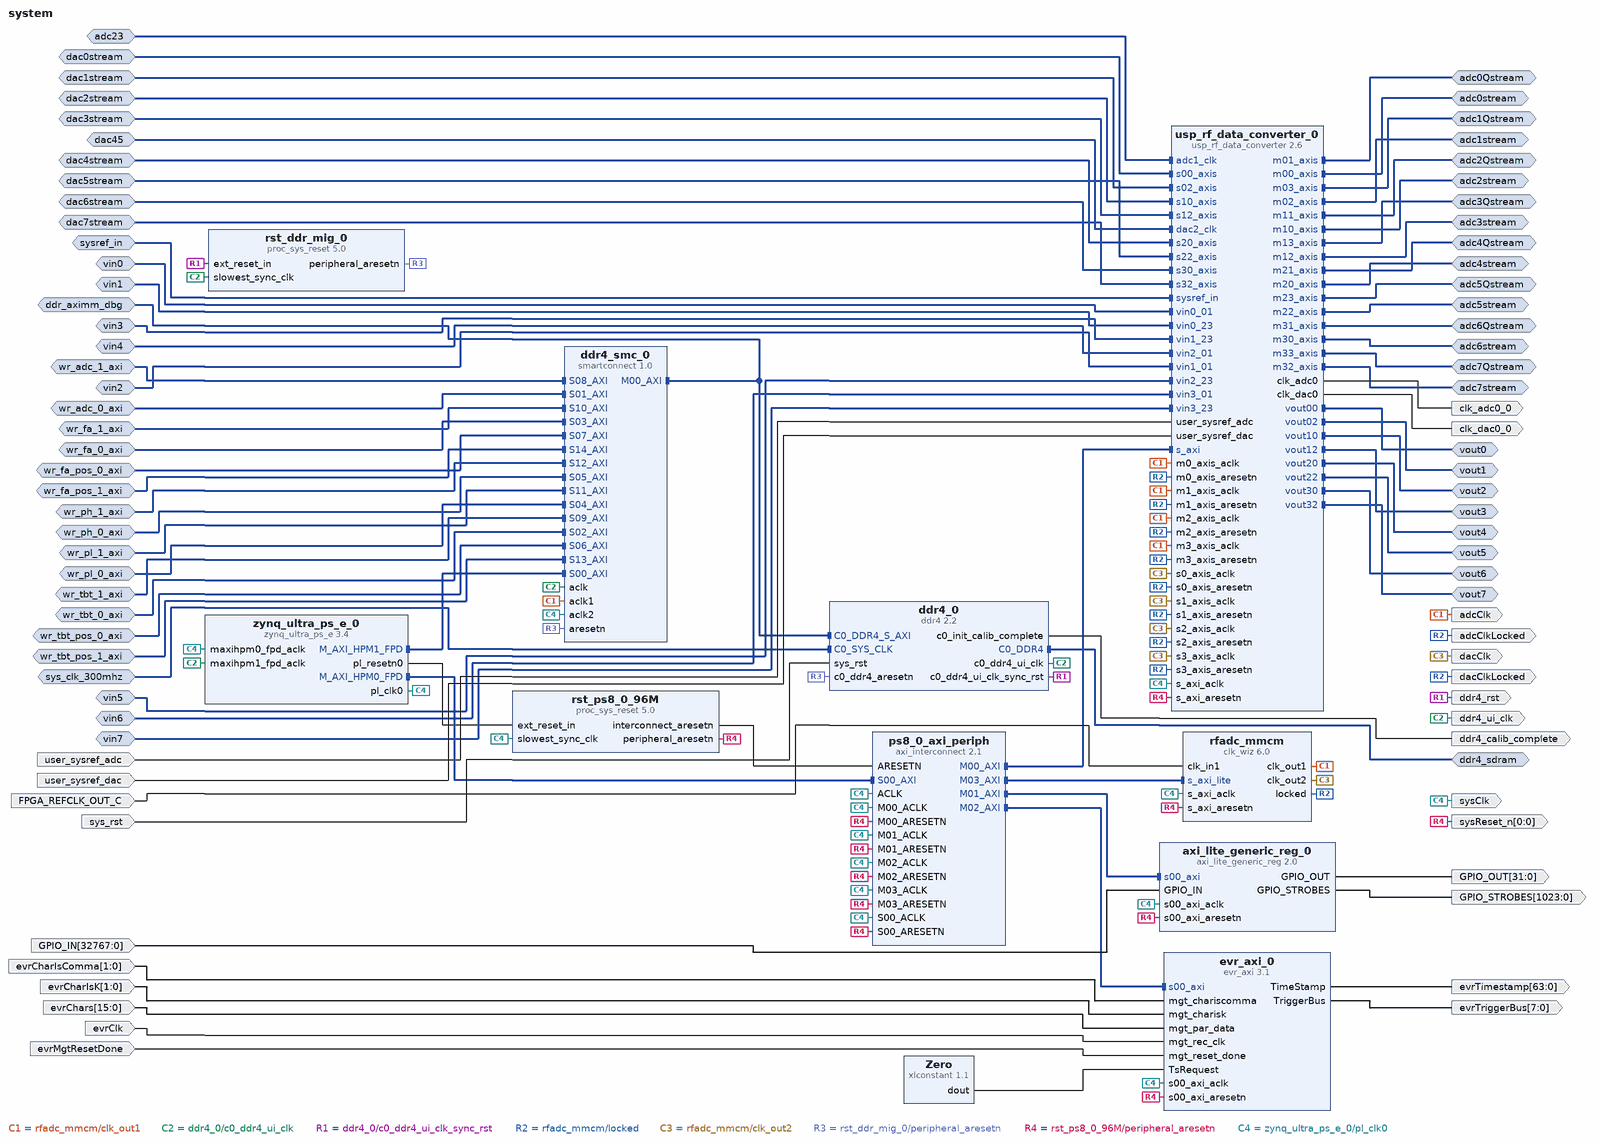
[diagram p0: block diagram of the top level]
# Vivado block design system, xczu48dr-fsvg1517-2-e, Vivado 2022.1
create_bd_design system

create_bd_intf_port -mode Slave -vlnv xilinx.com:display_usp_rf_data_converter:diff_pins_rtl:1.0 sysref_in
create_bd_intf_port -mode Master -vlnv xilinx.com:interface:axis_rtl:1.0 adc3stream
set_property -dict {CONFIG.FREQ_HZ 123386707} [get_bd_intf_ports adc3stream]
create_bd_intf_port -mode Master -vlnv xilinx.com:interface:axis_rtl:1.0 adc4stream
set_property -dict {CONFIG.FREQ_HZ 123386707} [get_bd_intf_ports adc4stream]
create_bd_intf_port -mode Master -vlnv xilinx.com:interface:axis_rtl:1.0 adc5stream
set_property -dict {CONFIG.FREQ_HZ 123386707} [get_bd_intf_ports adc5stream]
create_bd_intf_port -mode Master -vlnv xilinx.com:interface:axis_rtl:1.0 adc0stream
set_property -dict {CONFIG.FREQ_HZ 123386707} [get_bd_intf_ports adc0stream]
create_bd_intf_port -mode Master -vlnv xilinx.com:interface:axis_rtl:1.0 adc1stream
set_property -dict {CONFIG.FREQ_HZ 123386707} [get_bd_intf_ports adc1stream]
create_bd_intf_port -mode Master -vlnv xilinx.com:interface:axis_rtl:1.0 adc2stream
set_property -dict {CONFIG.FREQ_HZ 123386707} [get_bd_intf_ports adc2stream]
create_bd_intf_port -mode Slave -vlnv xilinx.com:interface:diff_analog_io_rtl:1.0 vin0
create_bd_intf_port -mode Slave -vlnv xilinx.com:interface:diff_analog_io_rtl:1.0 vin3
create_bd_intf_port -mode Slave -vlnv xilinx.com:interface:diff_analog_io_rtl:1.0 vin4
create_bd_intf_port -mode Slave -vlnv xilinx.com:interface:diff_analog_io_rtl:1.0 vin5
create_bd_intf_port -mode Slave -vlnv xilinx.com:interface:diff_analog_io_rtl:1.0 vin1
create_bd_intf_port -mode Slave -vlnv xilinx.com:interface:diff_analog_io_rtl:1.0 vin2
create_bd_intf_port -mode Slave -vlnv xilinx.com:interface:diff_clock_rtl:1.0 adc23
set_property -dict {CONFIG.FREQ_HZ 500000000} [get_bd_intf_ports adc23]
create_bd_intf_port -mode Master -vlnv xilinx.com:interface:axis_rtl:1.0 adc6stream
set_property -dict {CONFIG.FREQ_HZ 123386707} [get_bd_intf_ports adc6stream]
create_bd_intf_port -mode Master -vlnv xilinx.com:interface:axis_rtl:1.0 adc7stream
set_property -dict {CONFIG.FREQ_HZ 123386707} [get_bd_intf_ports adc7stream]
create_bd_intf_port -mode Slave -vlnv xilinx.com:interface:diff_analog_io_rtl:1.0 vin6
create_bd_intf_port -mode Slave -vlnv xilinx.com:interface:diff_analog_io_rtl:1.0 vin7
create_bd_intf_port -mode Slave -vlnv xilinx.com:interface:diff_clock_rtl:1.0 dac45
set_property -dict {CONFIG.FREQ_HZ 500000000} [get_bd_intf_ports dac45]
create_bd_intf_port -mode Master -vlnv xilinx.com:interface:axis_rtl:1.0 adc0Qstream
set_property -dict {CONFIG.FREQ_HZ 123386707} [get_bd_intf_ports adc0Qstream]
create_bd_intf_port -mode Master -vlnv xilinx.com:interface:axis_rtl:1.0 adc1Qstream
set_property -dict {CONFIG.FREQ_HZ 123386707} [get_bd_intf_ports adc1Qstream]
create_bd_intf_port -mode Master -vlnv xilinx.com:interface:axis_rtl:1.0 adc2Qstream
set_property -dict {CONFIG.FREQ_HZ 123386707} [get_bd_intf_ports adc2Qstream]
create_bd_intf_port -mode Master -vlnv xilinx.com:interface:axis_rtl:1.0 adc3Qstream
set_property -dict {CONFIG.FREQ_HZ 123386707} [get_bd_intf_ports adc3Qstream]
create_bd_intf_port -mode Master -vlnv xilinx.com:interface:axis_rtl:1.0 adc4Qstream
set_property -dict {CONFIG.FREQ_HZ 123386707} [get_bd_intf_ports adc4Qstream]
create_bd_intf_port -mode Master -vlnv xilinx.com:interface:axis_rtl:1.0 adc5Qstream
set_property -dict {CONFIG.FREQ_HZ 123386707} [get_bd_intf_ports adc5Qstream]
create_bd_intf_port -mode Master -vlnv xilinx.com:interface:axis_rtl:1.0 adc6Qstream
set_property -dict {CONFIG.FREQ_HZ 123386707} [get_bd_intf_ports adc6Qstream]
create_bd_intf_port -mode Master -vlnv xilinx.com:interface:axis_rtl:1.0 adc7Qstream
set_property -dict {CONFIG.FREQ_HZ 123386707} [get_bd_intf_ports adc7Qstream]
create_bd_intf_port -mode Master -vlnv xilinx.com:interface:diff_analog_io_rtl:1.0 vout0
create_bd_intf_port -mode Master -vlnv xilinx.com:interface:diff_analog_io_rtl:1.0 vout1
create_bd_intf_port -mode Master -vlnv xilinx.com:interface:diff_analog_io_rtl:1.0 vout2
create_bd_intf_port -mode Master -vlnv xilinx.com:interface:diff_analog_io_rtl:1.0 vout3
create_bd_intf_port -mode Master -vlnv xilinx.com:interface:diff_analog_io_rtl:1.0 vout4
create_bd_intf_port -mode Master -vlnv xilinx.com:interface:diff_analog_io_rtl:1.0 vout5
create_bd_intf_port -mode Master -vlnv xilinx.com:interface:diff_analog_io_rtl:1.0 vout6
create_bd_intf_port -mode Master -vlnv xilinx.com:interface:diff_analog_io_rtl:1.0 vout7
create_bd_intf_port -mode Master -vlnv xilinx.com:interface:ddr4_rtl:1.0 ddr4_sdram
create_bd_intf_port -mode Slave -vlnv xilinx.com:interface:diff_clock_rtl:1.0 sys_clk_300mhz
set_property -dict {CONFIG.FREQ_HZ 300000000} [get_bd_intf_ports sys_clk_300mhz]
create_bd_intf_port -mode Slave -vlnv xilinx.com:interface:aximm_rtl:1.0 wr_adc_0_axi
set_property -dict [list \
  CONFIG.ADDR_WIDTH 35 \
  CONFIG.ARUSER_WIDTH 0 \
  CONFIG.AWUSER_WIDTH 0 \
  CONFIG.BUSER_WIDTH 0 \
  CONFIG.DATA_WIDTH 256 \
  CONFIG.FREQ_HZ 123386707 \
  CONFIG.HAS_BRESP 1 \
  CONFIG.HAS_BURST 1 \
  CONFIG.HAS_CACHE 1 \
  CONFIG.HAS_LOCK 0 \
  CONFIG.HAS_PROT 0 \
  CONFIG.HAS_QOS 0 \
  CONFIG.HAS_REGION 0 \
  CONFIG.HAS_RRESP 1 \
  CONFIG.HAS_WSTRB 1 \
  CONFIG.ID_WIDTH 0 \
  CONFIG.MAX_BURST_LENGTH 256 \
  CONFIG.NUM_READ_OUTSTANDING 1 \
  CONFIG.NUM_READ_THREADS 1 \
  CONFIG.NUM_WRITE_OUTSTANDING 1 \
  CONFIG.NUM_WRITE_THREADS 1 \
  CONFIG.PROTOCOL AXI4 \
  CONFIG.READ_WRITE_MODE WRITE_ONLY \
  CONFIG.RUSER_BITS_PER_BYTE 0 \
  CONFIG.RUSER_WIDTH 0 \
  CONFIG.SUPPORTS_NARROW_BURST 0 \
  CONFIG.WUSER_BITS_PER_BYTE 0 \
  CONFIG.WUSER_WIDTH 0 \
  CONFIG.master_id 3 \
] [get_bd_intf_ports wr_adc_0_axi]
create_bd_intf_port -mode Slave -vlnv xilinx.com:interface:aximm_rtl:1.0 wr_tbt_0_axi
set_property -dict [list \
  CONFIG.ADDR_WIDTH 35 \
  CONFIG.ARUSER_WIDTH 0 \
  CONFIG.AWUSER_WIDTH 0 \
  CONFIG.BUSER_WIDTH 0 \
  CONFIG.DATA_WIDTH 128 \
  CONFIG.HAS_BRESP 1 \
  CONFIG.HAS_BURST 1 \
  CONFIG.HAS_CACHE 1 \
  CONFIG.HAS_LOCK 0 \
  CONFIG.HAS_PROT 0 \
  CONFIG.HAS_QOS 0 \
  CONFIG.HAS_REGION 0 \
  CONFIG.HAS_RRESP 1 \
  CONFIG.HAS_WSTRB 1 \
  CONFIG.ID_WIDTH 0 \
  CONFIG.MAX_BURST_LENGTH 256 \
  CONFIG.NUM_READ_OUTSTANDING 1 \
  CONFIG.NUM_READ_THREADS 1 \
  CONFIG.NUM_WRITE_OUTSTANDING 1 \
  CONFIG.NUM_WRITE_THREADS 1 \
  CONFIG.PROTOCOL AXI4 \
  CONFIG.READ_WRITE_MODE WRITE_ONLY \
  CONFIG.RUSER_BITS_PER_BYTE 0 \
  CONFIG.RUSER_WIDTH 0 \
  CONFIG.SUPPORTS_NARROW_BURST 0 \
  CONFIG.WUSER_BITS_PER_BYTE 0 \
  CONFIG.WUSER_WIDTH 0 \
  CONFIG.master_id 4 \
] [get_bd_intf_ports wr_tbt_0_axi]
create_bd_intf_port -mode Slave -vlnv xilinx.com:interface:aximm_rtl:1.0 wr_fa_0_axi
set_property -dict [list \
  CONFIG.ADDR_WIDTH 35 \
  CONFIG.ARUSER_WIDTH 0 \
  CONFIG.AWUSER_WIDTH 0 \
  CONFIG.BUSER_WIDTH 0 \
  CONFIG.DATA_WIDTH 128 \
  CONFIG.HAS_BRESP 1 \
  CONFIG.HAS_BURST 1 \
  CONFIG.HAS_CACHE 1 \
  CONFIG.HAS_LOCK 0 \
  CONFIG.HAS_PROT 0 \
  CONFIG.HAS_QOS 0 \
  CONFIG.HAS_REGION 0 \
  CONFIG.HAS_RRESP 1 \
  CONFIG.HAS_WSTRB 1 \
  CONFIG.ID_WIDTH 0 \
  CONFIG.MAX_BURST_LENGTH 256 \
  CONFIG.NUM_READ_OUTSTANDING 1 \
  CONFIG.NUM_READ_THREADS 1 \
  CONFIG.NUM_WRITE_OUTSTANDING 1 \
  CONFIG.NUM_WRITE_THREADS 1 \
  CONFIG.PROTOCOL AXI4 \
  CONFIG.READ_WRITE_MODE WRITE_ONLY \
  CONFIG.RUSER_BITS_PER_BYTE 0 \
  CONFIG.RUSER_WIDTH 0 \
  CONFIG.SUPPORTS_NARROW_BURST 0 \
  CONFIG.WUSER_BITS_PER_BYTE 0 \
  CONFIG.WUSER_WIDTH 0 \
  CONFIG.master_id 5 \
] [get_bd_intf_ports wr_fa_0_axi]
create_bd_intf_port -mode Slave -vlnv xilinx.com:interface:aximm_rtl:1.0 wr_pl_0_axi
set_property -dict [list \
  CONFIG.ADDR_WIDTH 35 \
  CONFIG.ARUSER_WIDTH 0 \
  CONFIG.AWUSER_WIDTH 0 \
  CONFIG.BUSER_WIDTH 0 \
  CONFIG.DATA_WIDTH 128 \
  CONFIG.HAS_BRESP 1 \
  CONFIG.HAS_BURST 1 \
  CONFIG.HAS_CACHE 1 \
  CONFIG.HAS_LOCK 0 \
  CONFIG.HAS_PROT 0 \
  CONFIG.HAS_QOS 0 \
  CONFIG.HAS_REGION 0 \
  CONFIG.HAS_RRESP 1 \
  CONFIG.HAS_WSTRB 1 \
  CONFIG.ID_WIDTH 0 \
  CONFIG.MAX_BURST_LENGTH 256 \
  CONFIG.NUM_READ_OUTSTANDING 1 \
  CONFIG.NUM_READ_THREADS 1 \
  CONFIG.NUM_WRITE_OUTSTANDING 1 \
  CONFIG.NUM_WRITE_THREADS 1 \
  CONFIG.PROTOCOL AXI4 \
  CONFIG.READ_WRITE_MODE WRITE_ONLY \
  CONFIG.RUSER_BITS_PER_BYTE 0 \
  CONFIG.RUSER_WIDTH 0 \
  CONFIG.SUPPORTS_NARROW_BURST 0 \
  CONFIG.WUSER_BITS_PER_BYTE 0 \
  CONFIG.WUSER_WIDTH 0 \
  CONFIG.master_id 6 \
] [get_bd_intf_ports wr_pl_0_axi]
create_bd_intf_port -mode Slave -vlnv xilinx.com:interface:aximm_rtl:1.0 wr_ph_0_axi
set_property -dict [list \
  CONFIG.ADDR_WIDTH 35 \
  CONFIG.ARUSER_WIDTH 0 \
  CONFIG.AWUSER_WIDTH 0 \
  CONFIG.BUSER_WIDTH 0 \
  CONFIG.DATA_WIDTH 128 \
  CONFIG.HAS_BRESP 1 \
  CONFIG.HAS_BURST 1 \
  CONFIG.HAS_CACHE 1 \
  CONFIG.HAS_LOCK 0 \
  CONFIG.HAS_PROT 0 \
  CONFIG.HAS_QOS 0 \
  CONFIG.HAS_REGION 0 \
  CONFIG.HAS_RRESP 1 \
  CONFIG.HAS_WSTRB 1 \
  CONFIG.ID_WIDTH 0 \
  CONFIG.MAX_BURST_LENGTH 256 \
  CONFIG.NUM_READ_OUTSTANDING 1 \
  CONFIG.NUM_READ_THREADS 1 \
  CONFIG.NUM_WRITE_OUTSTANDING 1 \
  CONFIG.NUM_WRITE_THREADS 1 \
  CONFIG.PROTOCOL AXI4 \
  CONFIG.READ_WRITE_MODE WRITE_ONLY \
  CONFIG.RUSER_BITS_PER_BYTE 0 \
  CONFIG.RUSER_WIDTH 0 \
  CONFIG.SUPPORTS_NARROW_BURST 0 \
  CONFIG.WUSER_BITS_PER_BYTE 0 \
  CONFIG.WUSER_WIDTH 0 \
  CONFIG.master_id 7 \
] [get_bd_intf_ports wr_ph_0_axi]
create_bd_intf_port -mode Slave -vlnv xilinx.com:interface:aximm_rtl:1.0 wr_adc_1_axi
set_property -dict [list \
  CONFIG.ADDR_WIDTH 35 \
  CONFIG.ARUSER_WIDTH 0 \
  CONFIG.AWUSER_WIDTH 0 \
  CONFIG.BUSER_WIDTH 0 \
  CONFIG.DATA_WIDTH 256 \
  CONFIG.FREQ_HZ 123386707 \
  CONFIG.HAS_BRESP 1 \
  CONFIG.HAS_BURST 1 \
  CONFIG.HAS_CACHE 1 \
  CONFIG.HAS_LOCK 0 \
  CONFIG.HAS_PROT 0 \
  CONFIG.HAS_QOS 0 \
  CONFIG.HAS_REGION 0 \
  CONFIG.HAS_RRESP 1 \
  CONFIG.HAS_WSTRB 1 \
  CONFIG.ID_WIDTH 0 \
  CONFIG.MAX_BURST_LENGTH 256 \
  CONFIG.NUM_READ_OUTSTANDING 1 \
  CONFIG.NUM_READ_THREADS 1 \
  CONFIG.NUM_WRITE_OUTSTANDING 1 \
  CONFIG.NUM_WRITE_THREADS 1 \
  CONFIG.PROTOCOL AXI4 \
  CONFIG.READ_WRITE_MODE WRITE_ONLY \
  CONFIG.RUSER_BITS_PER_BYTE 0 \
  CONFIG.RUSER_WIDTH 0 \
  CONFIG.SUPPORTS_NARROW_BURST 0 \
  CONFIG.WUSER_BITS_PER_BYTE 0 \
  CONFIG.WUSER_WIDTH 0 \
  CONFIG.master_id 10 \
] [get_bd_intf_ports wr_adc_1_axi]
create_bd_intf_port -mode Slave -vlnv xilinx.com:interface:aximm_rtl:1.0 wr_fa_1_axi
set_property -dict [list \
  CONFIG.ADDR_WIDTH 35 \
  CONFIG.ARUSER_WIDTH 0 \
  CONFIG.AWUSER_WIDTH 0 \
  CONFIG.BUSER_WIDTH 0 \
  CONFIG.DATA_WIDTH 128 \
  CONFIG.HAS_BRESP 1 \
  CONFIG.HAS_BURST 1 \
  CONFIG.HAS_CACHE 1 \
  CONFIG.HAS_LOCK 0 \
  CONFIG.HAS_PROT 0 \
  CONFIG.HAS_QOS 0 \
  CONFIG.HAS_REGION 0 \
  CONFIG.HAS_RRESP 1 \
  CONFIG.HAS_WSTRB 1 \
  CONFIG.ID_WIDTH 0 \
  CONFIG.MAX_BURST_LENGTH 256 \
  CONFIG.NUM_READ_OUTSTANDING 1 \
  CONFIG.NUM_READ_THREADS 1 \
  CONFIG.NUM_WRITE_OUTSTANDING 1 \
  CONFIG.NUM_WRITE_THREADS 1 \
  CONFIG.PROTOCOL AXI4 \
  CONFIG.READ_WRITE_MODE WRITE_ONLY \
  CONFIG.RUSER_BITS_PER_BYTE 0 \
  CONFIG.RUSER_WIDTH 0 \
  CONFIG.SUPPORTS_NARROW_BURST 0 \
  CONFIG.WUSER_BITS_PER_BYTE 0 \
  CONFIG.WUSER_WIDTH 0 \
  CONFIG.master_id 12 \
] [get_bd_intf_ports wr_fa_1_axi]
create_bd_intf_port -mode Slave -vlnv xilinx.com:interface:aximm_rtl:1.0 wr_ph_1_axi
set_property -dict [list \
  CONFIG.ADDR_WIDTH 35 \
  CONFIG.ARUSER_WIDTH 0 \
  CONFIG.AWUSER_WIDTH 0 \
  CONFIG.BUSER_WIDTH 0 \
  CONFIG.DATA_WIDTH 128 \
  CONFIG.HAS_BRESP 1 \
  CONFIG.HAS_BURST 1 \
  CONFIG.HAS_CACHE 1 \
  CONFIG.HAS_LOCK 0 \
  CONFIG.HAS_PROT 0 \
  CONFIG.HAS_QOS 0 \
  CONFIG.HAS_REGION 0 \
  CONFIG.HAS_RRESP 1 \
  CONFIG.HAS_WSTRB 1 \
  CONFIG.ID_WIDTH 0 \
  CONFIG.MAX_BURST_LENGTH 256 \
  CONFIG.NUM_READ_OUTSTANDING 1 \
  CONFIG.NUM_READ_THREADS 1 \
  CONFIG.NUM_WRITE_OUTSTANDING 1 \
  CONFIG.NUM_WRITE_THREADS 1 \
  CONFIG.PROTOCOL AXI4 \
  CONFIG.READ_WRITE_MODE WRITE_ONLY \
  CONFIG.RUSER_BITS_PER_BYTE 0 \
  CONFIG.RUSER_WIDTH 0 \
  CONFIG.SUPPORTS_NARROW_BURST 0 \
  CONFIG.WUSER_BITS_PER_BYTE 0 \
  CONFIG.WUSER_WIDTH 0 \
  CONFIG.master_id 14 \
] [get_bd_intf_ports wr_ph_1_axi]
create_bd_intf_port -mode Slave -vlnv xilinx.com:interface:aximm_rtl:1.0 wr_pl_1_axi
set_property -dict [list \
  CONFIG.ADDR_WIDTH 35 \
  CONFIG.ARUSER_WIDTH 0 \
  CONFIG.AWUSER_WIDTH 0 \
  CONFIG.BUSER_WIDTH 0 \
  CONFIG.DATA_WIDTH 128 \
  CONFIG.HAS_BRESP 1 \
  CONFIG.HAS_BURST 1 \
  CONFIG.HAS_CACHE 1 \
  CONFIG.HAS_LOCK 0 \
  CONFIG.HAS_PROT 0 \
  CONFIG.HAS_QOS 0 \
  CONFIG.HAS_REGION 0 \
  CONFIG.HAS_RRESP 1 \
  CONFIG.HAS_WSTRB 1 \
  CONFIG.ID_WIDTH 0 \
  CONFIG.MAX_BURST_LENGTH 256 \
  CONFIG.NUM_READ_OUTSTANDING 1 \
  CONFIG.NUM_READ_THREADS 1 \
  CONFIG.NUM_WRITE_OUTSTANDING 1 \
  CONFIG.NUM_WRITE_THREADS 1 \
  CONFIG.PROTOCOL AXI4 \
  CONFIG.READ_WRITE_MODE WRITE_ONLY \
  CONFIG.RUSER_BITS_PER_BYTE 0 \
  CONFIG.RUSER_WIDTH 0 \
  CONFIG.SUPPORTS_NARROW_BURST 0 \
  CONFIG.WUSER_BITS_PER_BYTE 0 \
  CONFIG.WUSER_WIDTH 0 \
  CONFIG.master_id 13 \
] [get_bd_intf_ports wr_pl_1_axi]
create_bd_intf_port -mode Slave -vlnv xilinx.com:interface:aximm_rtl:1.0 wr_tbt_1_axi
set_property -dict [list \
  CONFIG.ADDR_WIDTH 35 \
  CONFIG.ARUSER_WIDTH 0 \
  CONFIG.AWUSER_WIDTH 0 \
  CONFIG.BUSER_WIDTH 0 \
  CONFIG.DATA_WIDTH 128 \
  CONFIG.HAS_BRESP 1 \
  CONFIG.HAS_BURST 1 \
  CONFIG.HAS_CACHE 1 \
  CONFIG.HAS_LOCK 0 \
  CONFIG.HAS_PROT 0 \
  CONFIG.HAS_QOS 0 \
  CONFIG.HAS_REGION 0 \
  CONFIG.HAS_RRESP 1 \
  CONFIG.HAS_WSTRB 1 \
  CONFIG.ID_WIDTH 0 \
  CONFIG.MAX_BURST_LENGTH 256 \
  CONFIG.NUM_READ_OUTSTANDING 1 \
  CONFIG.NUM_READ_THREADS 1 \
  CONFIG.NUM_WRITE_OUTSTANDING 1 \
  CONFIG.NUM_WRITE_THREADS 1 \
  CONFIG.PROTOCOL AXI4 \
  CONFIG.READ_WRITE_MODE WRITE_ONLY \
  CONFIG.RUSER_BITS_PER_BYTE 0 \
  CONFIG.RUSER_WIDTH 0 \
  CONFIG.SUPPORTS_NARROW_BURST 0 \
  CONFIG.WUSER_BITS_PER_BYTE 0 \
  CONFIG.WUSER_WIDTH 0 \
  CONFIG.master_id 11 \
] [get_bd_intf_ports wr_tbt_1_axi]
create_bd_intf_port -mode Monitor -vlnv xilinx.com:interface:aximm_rtl:1.0 ddr_aximm_dbg
set_property -dict [list \
  CONFIG.ADDR_WIDTH 32 \
  CONFIG.ARUSER_WIDTH 0 \
  CONFIG.AWUSER_WIDTH 0 \
  CONFIG.DATA_WIDTH 256 \
  CONFIG.PROTOCOL AXI4 \
] [get_bd_intf_ports ddr_aximm_dbg]
create_bd_intf_port -mode Slave -vlnv xilinx.com:interface:axis_rtl:1.0 dac0stream
set_property -dict [list \
  CONFIG.FREQ_HZ 123386707 \
  CONFIG.HAS_TKEEP 0 \
  CONFIG.HAS_TLAST 0 \
  CONFIG.HAS_TREADY 1 \
  CONFIG.HAS_TSTRB 0 \
  CONFIG.LAYERED_METADATA undef \
  CONFIG.TDATA_NUM_BYTES 4 \
  CONFIG.TDEST_WIDTH 0 \
  CONFIG.TID_WIDTH 0 \
  CONFIG.TUSER_WIDTH 0 \
] [get_bd_intf_ports dac0stream]
create_bd_intf_port -mode Slave -vlnv xilinx.com:interface:axis_rtl:1.0 dac1stream
set_property -dict [list \
  CONFIG.FREQ_HZ 123386707 \
  CONFIG.HAS_TKEEP 0 \
  CONFIG.HAS_TLAST 0 \
  CONFIG.HAS_TREADY 1 \
  CONFIG.HAS_TSTRB 0 \
  CONFIG.LAYERED_METADATA undef \
  CONFIG.TDATA_NUM_BYTES 4 \
  CONFIG.TDEST_WIDTH 0 \
  CONFIG.TID_WIDTH 0 \
  CONFIG.TUSER_WIDTH 0 \
] [get_bd_intf_ports dac1stream]
create_bd_intf_port -mode Slave -vlnv xilinx.com:interface:axis_rtl:1.0 dac2stream
set_property -dict [list \
  CONFIG.FREQ_HZ 123386707 \
  CONFIG.HAS_TKEEP 0 \
  CONFIG.HAS_TLAST 0 \
  CONFIG.HAS_TREADY 1 \
  CONFIG.HAS_TSTRB 0 \
  CONFIG.LAYERED_METADATA undef \
  CONFIG.TDATA_NUM_BYTES 4 \
  CONFIG.TDEST_WIDTH 0 \
  CONFIG.TID_WIDTH 0 \
  CONFIG.TUSER_WIDTH 0 \
] [get_bd_intf_ports dac2stream]
create_bd_intf_port -mode Slave -vlnv xilinx.com:interface:axis_rtl:1.0 dac3stream
set_property -dict [list \
  CONFIG.FREQ_HZ 123386707 \
  CONFIG.HAS_TKEEP 0 \
  CONFIG.HAS_TLAST 0 \
  CONFIG.HAS_TREADY 1 \
  CONFIG.HAS_TSTRB 0 \
  CONFIG.LAYERED_METADATA undef \
  CONFIG.TDATA_NUM_BYTES 4 \
  CONFIG.TDEST_WIDTH 0 \
  CONFIG.TID_WIDTH 0 \
  CONFIG.TUSER_WIDTH 0 \
] [get_bd_intf_ports dac3stream]
create_bd_intf_port -mode Slave -vlnv xilinx.com:interface:axis_rtl:1.0 dac4stream
set_property -dict [list \
  CONFIG.FREQ_HZ 123386707 \
  CONFIG.HAS_TKEEP 0 \
  CONFIG.HAS_TLAST 0 \
  CONFIG.HAS_TREADY 1 \
  CONFIG.HAS_TSTRB 0 \
  CONFIG.LAYERED_METADATA undef \
  CONFIG.TDATA_NUM_BYTES 4 \
  CONFIG.TDEST_WIDTH 0 \
  CONFIG.TID_WIDTH 0 \
  CONFIG.TUSER_WIDTH 0 \
] [get_bd_intf_ports dac4stream]
create_bd_intf_port -mode Slave -vlnv xilinx.com:interface:axis_rtl:1.0 dac5stream
set_property -dict [list \
  CONFIG.FREQ_HZ 123386707 \
  CONFIG.HAS_TKEEP 0 \
  CONFIG.HAS_TLAST 0 \
  CONFIG.HAS_TREADY 1 \
  CONFIG.HAS_TSTRB 0 \
  CONFIG.LAYERED_METADATA undef \
  CONFIG.TDATA_NUM_BYTES 4 \
  CONFIG.TDEST_WIDTH 0 \
  CONFIG.TID_WIDTH 0 \
  CONFIG.TUSER_WIDTH 0 \
] [get_bd_intf_ports dac5stream]
create_bd_intf_port -mode Slave -vlnv xilinx.com:interface:axis_rtl:1.0 dac6stream
set_property -dict [list \
  CONFIG.FREQ_HZ 123386707 \
  CONFIG.HAS_TKEEP 0 \
  CONFIG.HAS_TLAST 0 \
  CONFIG.HAS_TREADY 1 \
  CONFIG.HAS_TSTRB 0 \
  CONFIG.LAYERED_METADATA undef \
  CONFIG.TDATA_NUM_BYTES 4 \
  CONFIG.TDEST_WIDTH 0 \
  CONFIG.TID_WIDTH 0 \
  CONFIG.TUSER_WIDTH 0 \
] [get_bd_intf_ports dac6stream]
create_bd_intf_port -mode Slave -vlnv xilinx.com:interface:axis_rtl:1.0 dac7stream
set_property -dict [list \
  CONFIG.FREQ_HZ 123386707 \
  CONFIG.HAS_TKEEP 0 \
  CONFIG.HAS_TLAST 0 \
  CONFIG.HAS_TREADY 1 \
  CONFIG.HAS_TSTRB 0 \
  CONFIG.LAYERED_METADATA undef \
  CONFIG.TDATA_NUM_BYTES 4 \
  CONFIG.TDEST_WIDTH 0 \
  CONFIG.TID_WIDTH 0 \
  CONFIG.TUSER_WIDTH 0 \
] [get_bd_intf_ports dac7stream]
create_bd_intf_port -mode Slave -vlnv xilinx.com:interface:aximm_rtl:1.0 wr_fa_pos_0_axi
set_property -dict [list \
  CONFIG.ADDR_WIDTH 35 \
  CONFIG.ARUSER_WIDTH 0 \
  CONFIG.AWUSER_WIDTH 0 \
  CONFIG.BUSER_WIDTH 0 \
  CONFIG.DATA_WIDTH 128 \
  CONFIG.HAS_BRESP 1 \
  CONFIG.HAS_BURST 1 \
  CONFIG.HAS_CACHE 1 \
  CONFIG.HAS_LOCK 0 \
  CONFIG.HAS_PROT 0 \
  CONFIG.HAS_QOS 0 \
  CONFIG.HAS_REGION 0 \
  CONFIG.HAS_RRESP 1 \
  CONFIG.HAS_WSTRB 1 \
  CONFIG.ID_WIDTH 0 \
  CONFIG.MAX_BURST_LENGTH 256 \
  CONFIG.NUM_READ_OUTSTANDING 1 \
  CONFIG.NUM_READ_THREADS 1 \
  CONFIG.NUM_WRITE_OUTSTANDING 1 \
  CONFIG.NUM_WRITE_THREADS 1 \
  CONFIG.PROTOCOL AXI4 \
  CONFIG.READ_WRITE_MODE WRITE_ONLY \
  CONFIG.RUSER_BITS_PER_BYTE 0 \
  CONFIG.RUSER_WIDTH 0 \
  CONFIG.SUPPORTS_NARROW_BURST 0 \
  CONFIG.WUSER_BITS_PER_BYTE 0 \
  CONFIG.WUSER_WIDTH 0 \
  CONFIG.master_id 9 \
] [get_bd_intf_ports wr_fa_pos_0_axi]
create_bd_intf_port -mode Slave -vlnv xilinx.com:interface:aximm_rtl:1.0 wr_tbt_pos_0_axi
set_property -dict [list \
  CONFIG.ADDR_WIDTH 35 \
  CONFIG.ARUSER_WIDTH 0 \
  CONFIG.AWUSER_WIDTH 0 \
  CONFIG.BUSER_WIDTH 0 \
  CONFIG.DATA_WIDTH 128 \
  CONFIG.HAS_BRESP 1 \
  CONFIG.HAS_BURST 1 \
  CONFIG.HAS_CACHE 1 \
  CONFIG.HAS_LOCK 0 \
  CONFIG.HAS_PROT 0 \
  CONFIG.HAS_QOS 0 \
  CONFIG.HAS_REGION 0 \
  CONFIG.HAS_RRESP 1 \
  CONFIG.HAS_WSTRB 1 \
  CONFIG.ID_WIDTH 0 \
  CONFIG.MAX_BURST_LENGTH 256 \
  CONFIG.NUM_READ_OUTSTANDING 1 \
  CONFIG.NUM_READ_THREADS 1 \
  CONFIG.NUM_WRITE_OUTSTANDING 1 \
  CONFIG.NUM_WRITE_THREADS 1 \
  CONFIG.PROTOCOL AXI4 \
  CONFIG.READ_WRITE_MODE WRITE_ONLY \
  CONFIG.RUSER_BITS_PER_BYTE 0 \
  CONFIG.RUSER_WIDTH 0 \
  CONFIG.SUPPORTS_NARROW_BURST 0 \
  CONFIG.WUSER_BITS_PER_BYTE 0 \
  CONFIG.WUSER_WIDTH 0 \
  CONFIG.master_id 8 \
] [get_bd_intf_ports wr_tbt_pos_0_axi]
create_bd_intf_port -mode Slave -vlnv xilinx.com:interface:aximm_rtl:1.0 wr_fa_pos_1_axi
set_property -dict [list \
  CONFIG.ADDR_WIDTH 35 \
  CONFIG.ARUSER_WIDTH 0 \
  CONFIG.AWUSER_WIDTH 0 \
  CONFIG.BUSER_WIDTH 0 \
  CONFIG.DATA_WIDTH 128 \
  CONFIG.HAS_BRESP 1 \
  CONFIG.HAS_BURST 1 \
  CONFIG.HAS_CACHE 1 \
  CONFIG.HAS_LOCK 0 \
  CONFIG.HAS_PROT 0 \
  CONFIG.HAS_QOS 0 \
  CONFIG.HAS_REGION 0 \
  CONFIG.HAS_RRESP 1 \
  CONFIG.HAS_WSTRB 1 \
  CONFIG.ID_WIDTH 0 \
  CONFIG.MAX_BURST_LENGTH 256 \
  CONFIG.NUM_READ_OUTSTANDING 1 \
  CONFIG.NUM_READ_THREADS 1 \
  CONFIG.NUM_WRITE_OUTSTANDING 1 \
  CONFIG.NUM_WRITE_THREADS 1 \
  CONFIG.PROTOCOL AXI4 \
  CONFIG.READ_WRITE_MODE WRITE_ONLY \
  CONFIG.RUSER_BITS_PER_BYTE 0 \
  CONFIG.RUSER_WIDTH 0 \
  CONFIG.SUPPORTS_NARROW_BURST 0 \
  CONFIG.WUSER_BITS_PER_BYTE 0 \
  CONFIG.WUSER_WIDTH 0 \
  CONFIG.master_id 16 \
] [get_bd_intf_ports wr_fa_pos_1_axi]
create_bd_intf_port -mode Slave -vlnv xilinx.com:interface:aximm_rtl:1.0 wr_tbt_pos_1_axi
set_property -dict [list \
  CONFIG.ADDR_WIDTH 35 \
  CONFIG.ARUSER_WIDTH 0 \
  CONFIG.AWUSER_WIDTH 0 \
  CONFIG.BUSER_WIDTH 0 \
  CONFIG.DATA_WIDTH 128 \
  CONFIG.HAS_BRESP 1 \
  CONFIG.HAS_BURST 1 \
  CONFIG.HAS_CACHE 1 \
  CONFIG.HAS_LOCK 0 \
  CONFIG.HAS_PROT 0 \
  CONFIG.HAS_QOS 0 \
  CONFIG.HAS_REGION 0 \
  CONFIG.HAS_RRESP 1 \
  CONFIG.HAS_WSTRB 1 \
  CONFIG.ID_WIDTH 0 \
  CONFIG.MAX_BURST_LENGTH 256 \
  CONFIG.NUM_READ_OUTSTANDING 1 \
  CONFIG.NUM_READ_THREADS 1 \
  CONFIG.NUM_WRITE_OUTSTANDING 1 \
  CONFIG.NUM_WRITE_THREADS 1 \
  CONFIG.PROTOCOL AXI4 \
  CONFIG.READ_WRITE_MODE WRITE_ONLY \
  CONFIG.RUSER_BITS_PER_BYTE 0 \
  CONFIG.RUSER_WIDTH 0 \
  CONFIG.SUPPORTS_NARROW_BURST 0 \
  CONFIG.WUSER_BITS_PER_BYTE 0 \
  CONFIG.WUSER_WIDTH 0 \
  CONFIG.master_id 15 \
] [get_bd_intf_ports wr_tbt_pos_1_axi]
create_bd_port -dir O -type clk sysClk
set_property -dict [list \
  CONFIG.ASSOCIATED_BUSIF wr_tbt_0_axi:wr_fa_0_axi:wr_pl_0_axi:wr_ph_0_axi:wr_tbt_1_axi:wr_fa_1_axi:wr_pl_1_axi:wr_ph_1_axi:wr_tbt_pos_0_axi:wr_fa_pos_0_axi:wr_tbt_pos_1_axi:wr_fa_pos_1_axi \
] [get_bd_ports sysClk]
create_bd_port -dir O -from 0 -to 0 -type rst sysReset_n
create_bd_port -dir I -from 32767 -to 0 GPIO_IN
create_bd_port -dir O -from 1023 -to 0 GPIO_STROBES
create_bd_port -dir O -from 31 -to 0 GPIO_OUT
create_bd_port -dir O -from 7 -to 0 evrTriggerBus
create_bd_port -dir O -from 63 -to 0 evrTimestamp
create_bd_port -dir I evrClk
create_bd_port -dir I -from 15 -to 0 evrChars
create_bd_port -dir I -from 1 -to 0 evrCharIsComma
create_bd_port -dir I -from 1 -to 0 evrCharIsK
create_bd_port -dir I evrMgtResetDone
create_bd_port -dir O -type clk clk_adc0_0
set_property -dict {CONFIG.FREQ_HZ 38558000} [get_bd_ports clk_adc0_0]
create_bd_port -dir I user_sysref_adc
create_bd_port -dir I -type clk FPGA_REFCLK_OUT_C
set_property -dict {CONFIG.FREQ_HZ 499640000} [get_bd_ports FPGA_REFCLK_OUT_C]
create_bd_port -dir O -type clk adcClk
set_property -dict [list \
  CONFIG.ASSOCIATED_BUSIF adc0stream:adc1stream:adc2stream:adc3stream:adc4stream:adc5stream:adc6stream:adc7stream:adc0Qstream:adc1Qstream:adc2Qstream:adc3Qstream:adc4Qstream:adc5Qstream:adc6Qstream:adc7Qstream:wr_adc_0_axi:wr_adc_1_axi \
  CONFIG.FREQ_HZ 123386707 \
] [get_bd_ports adcClk]
create_bd_port -dir O adcClkLocked
create_bd_port -dir I user_sysref_dac
create_bd_port -dir O -type clk clk_dac0_0
set_property -dict {CONFIG.FREQ_HZ 308467000} [get_bd_ports clk_dac0_0]
create_bd_port -dir O -type clk dacClk
set_property -dict [list \
  CONFIG.ASSOCIATED_BUSIF dac0stream:dac1stream:dac2stream:dac3stream:dac4stream:dac5stream:dac6stream:dac7stream \
  CONFIG.FREQ_HZ 123386707 \
] [get_bd_ports dacClk]
create_bd_port -dir O dacClkLocked
create_bd_port -dir O -type data ddr4_calib_complete
create_bd_port -dir I -type rst sys_rst
set_property -dict {CONFIG.POLARITY ACTIVE_HIGH} [get_bd_ports sys_rst]
create_bd_port -dir O -type clk ddr4_ui_clk
set_property -dict {CONFIG.ASSOCIATED_BUSIF ddr_aximm_dbg} [get_bd_ports ddr4_ui_clk]
create_bd_port -dir O -type rst ddr4_rst

create_bd_cell -type ip -vlnv xilinx.com:ip:xlconstant:1.1 Zero
set_property -dict {CONFIG.CONST_VAL 0} [get_bd_cells Zero]
create_bd_cell -type ip -vlnv lbl.gov:user:axi_lite_generic_reg:2.0 axi_lite_generic_reg_0
set_property -dict {CONFIG.C_S00_AXI_ADDR_WIDTH 12} [get_bd_cells axi_lite_generic_reg_0]
create_bd_cell -type ip -vlnv lbl.gov:user:evr_axi:3.1 evr_axi_0
set_property -dict {CONFIG.C_S00_AXI_ADDR_WIDTH 15} [get_bd_cells evr_axi_0]
create_bd_cell -type ip -vlnv xilinx.com:ip:axi_interconnect:2.1 ps8_0_axi_periph
set_property -dict {CONFIG.NUM_MI 4 CONFIG.NUM_SI 1} [get_bd_cells ps8_0_axi_periph]
create_bd_cell -type ip -vlnv xilinx.com:ip:clk_wiz:6.0 rfadc_mmcm
set_property -dict [list \
  CONFIG.CLKIN1_JITTER_PS 20.01 \
  CONFIG.CLKOUT1_DRIVES BUFG \
  CONFIG.CLKOUT1_JITTER 190.914 \
  CONFIG.CLKOUT1_PHASE_ERROR 338.733 \
  CONFIG.CLKOUT1_REQUESTED_OUT_FREQ 123.38671 \
  CONFIG.CLKOUT2_DRIVES BUFG \
  CONFIG.CLKOUT2_JITTER 190.914 \
  CONFIG.CLKOUT2_PHASE_ERROR 338.733 \
  CONFIG.CLKOUT2_REQUESTED_OUT_FREQ 123.38671 \
  CONFIG.CLKOUT2_USED true \
  CONFIG.CLKOUT3_DRIVES Buffer \
  CONFIG.CLKOUT4_DRIVES Buffer \
  CONFIG.CLKOUT5_DRIVES Buffer \
  CONFIG.CLKOUT6_DRIVES Buffer \
  CONFIG.CLKOUT7_DRIVES Buffer \
  CONFIG.FEEDBACK_SOURCE FDBK_AUTO \
  CONFIG.MMCM_CLKFBOUT_MULT_F 101.250 \
  CONFIG.MMCM_CLKIN1_PERIOD 2.001 \
  CONFIG.MMCM_CLKIN2_PERIOD 10.0 \
  CONFIG.MMCM_CLKOUT0_DIVIDE_F 10.000 \
  CONFIG.MMCM_CLKOUT1_DIVIDE 10 \
  CONFIG.MMCM_DIVCLK_DIVIDE 41 \
  CONFIG.NUM_OUT_CLKS 2 \
  CONFIG.PRIM_IN_FREQ 499.640 \
  CONFIG.PRIM_SOURCE No_buffer \
  CONFIG.SECONDARY_SOURCE Single_ended_clock_capable_pin \
  CONFIG.USE_DYN_RECONFIG true \
  CONFIG.USE_PHASE_ALIGNMENT true \
] [get_bd_cells rfadc_mmcm]
create_bd_cell -type ip -vlnv xilinx.com:ip:proc_sys_reset:5.0 rst_ps8_0_96M
create_bd_cell -type ip -vlnv xilinx.com:ip:usp_rf_data_converter:2.6 usp_rf_data_converter_0
set_property -dict [list \
  CONFIG.ADC0_Clock_Source 1 \
  CONFIG.ADC0_Link_Coupling 0 \
  CONFIG.ADC0_Multi_Tile_Sync true \
  CONFIG.ADC0_Outclk_Freq 38.558 \
  CONFIG.ADC0_PLL_Enable false \
  CONFIG.ADC0_Refclk_Freq 4935.468 \
  CONFIG.ADC0_Sampling_Rate 4.935468 \
  CONFIG.ADC1_Clock_Dist 1 \
  CONFIG.ADC1_Link_Coupling 0 \
  CONFIG.ADC1_Multi_Tile_Sync true \
  CONFIG.ADC1_Outclk_Freq 38.558 \
  CONFIG.ADC1_PLL_Enable false \
  CONFIG.ADC1_Refclk_Freq 4935.468 \
  CONFIG.ADC1_Sampling_Rate 4.935468 \
  CONFIG.ADC224_En true \
  CONFIG.ADC225_En true \
  CONFIG.ADC226_En true \
  CONFIG.ADC227_En true \
  CONFIG.ADC2_Clock_Source 1 \
  CONFIG.ADC2_Link_Coupling 0 \
  CONFIG.ADC2_Multi_Tile_Sync true \
  CONFIG.ADC2_Outclk_Freq 38.558 \
  CONFIG.ADC2_PLL_Enable false \
  CONFIG.ADC2_Refclk_Freq 4935.468 \
  CONFIG.ADC2_Sampling_Rate 4.935468 \
  CONFIG.ADC3_Clock_Source 1 \
  CONFIG.ADC3_Link_Coupling 0 \
  CONFIG.ADC3_Multi_Tile_Sync true \
  CONFIG.ADC3_Outclk_Freq 38.558 \
  CONFIG.ADC3_PLL_Enable false \
  CONFIG.ADC3_Refclk_Freq 4935.468 \
  CONFIG.ADC3_Sampling_Rate 4.935468 \
  CONFIG.ADC_Data_Type00 1 \
  CONFIG.ADC_Data_Type02 1 \
  CONFIG.ADC_Data_Type10 1 \
  CONFIG.ADC_Data_Type12 1 \
  CONFIG.ADC_Data_Type20 1 \
  CONFIG.ADC_Data_Type22 1 \
  CONFIG.ADC_Data_Type30 1 \
  CONFIG.ADC_Data_Type32 1 \
  CONFIG.ADC_Data_Width00 1 \
  CONFIG.ADC_Data_Width02 1 \
  CONFIG.ADC_Data_Width10 1 \
  CONFIG.ADC_Data_Width12 1 \
  CONFIG.ADC_Data_Width20 1 \
  CONFIG.ADC_Data_Width22 1 \
  CONFIG.ADC_Data_Width30 1 \
  CONFIG.ADC_Data_Width32 1 \
  CONFIG.ADC_Decimation_Mode00 40 \
  CONFIG.ADC_Decimation_Mode02 40 \
  CONFIG.ADC_Decimation_Mode10 40 \
  CONFIG.ADC_Decimation_Mode12 40 \
  CONFIG.ADC_Decimation_Mode20 40 \
  CONFIG.ADC_Decimation_Mode22 40 \
  CONFIG.ADC_Decimation_Mode30 40 \
  CONFIG.ADC_Decimation_Mode32 40 \
  CONFIG.ADC_Dither00 false \
  CONFIG.ADC_Dither02 false \
  CONFIG.ADC_Dither10 false \
  CONFIG.ADC_Dither12 false \
  CONFIG.ADC_Dither20 false \
  CONFIG.ADC_Dither22 false \
  CONFIG.ADC_Dither30 false \
  CONFIG.ADC_Dither32 false \
  CONFIG.ADC_Mixer_Mode00 0 \
  CONFIG.ADC_Mixer_Mode02 0 \
  CONFIG.ADC_Mixer_Mode10 0 \
  CONFIG.ADC_Mixer_Mode12 0 \
  CONFIG.ADC_Mixer_Mode20 0 \
  CONFIG.ADC_Mixer_Mode22 0 \
  CONFIG.ADC_Mixer_Mode30 0 \
  CONFIG.ADC_Mixer_Mode32 0 \
  CONFIG.ADC_Mixer_Type00 2 \
  CONFIG.ADC_Mixer_Type02 2 \
  CONFIG.ADC_Mixer_Type10 2 \
  CONFIG.ADC_Mixer_Type12 2 \
  CONFIG.ADC_Mixer_Type20 2 \
  CONFIG.ADC_Mixer_Type22 2 \
  CONFIG.ADC_Mixer_Type30 2 \
  CONFIG.ADC_Mixer_Type32 2 \
  CONFIG.ADC_NCO_Freq00 -0.5057331707317073 \
  CONFIG.ADC_NCO_Freq02 -0.5057331707317073 \
  CONFIG.ADC_NCO_Freq10 -0.5057331707317073 \
  CONFIG.ADC_NCO_Freq12 -0.5057331707317073 \
  CONFIG.ADC_NCO_Freq20 -0.5057331707317073 \
  CONFIG.ADC_NCO_Freq22 -0.5057331707317073 \
  CONFIG.ADC_NCO_Freq30 -0.5057331707317073 \
  CONFIG.ADC_NCO_Freq32 -0.5057331707317073 \
  CONFIG.ADC_Slice00_Enable true \
  CONFIG.ADC_Slice02_Enable true \
  CONFIG.ADC_Slice10_Enable true \
  CONFIG.ADC_Slice12_Enable true \
  CONFIG.ADC_Slice20_Enable true \
  CONFIG.ADC_Slice22_Enable true \
  CONFIG.ADC_Slice30_Enable true \
  CONFIG.ADC_Slice32_Enable true \
  CONFIG.Calibration_Freeze false \
  CONFIG.Converter_Setup 1 \
  CONFIG.DAC0_Clock_Source 6 \
  CONFIG.DAC0_Multi_Tile_Sync true \
  CONFIG.DAC0_Outclk_Freq 308.467 \
  CONFIG.DAC0_Refclk_Freq 4935.468 \
  CONFIG.DAC0_Sampling_Rate 4.935468 \
  CONFIG.DAC1_Clock_Source 6 \
  CONFIG.DAC1_Multi_Tile_Sync true \
  CONFIG.DAC1_Outclk_Freq 308.467 \
  CONFIG.DAC1_Refclk_Freq 4935.468 \
  CONFIG.DAC1_Sampling_Rate 4.935468 \
  CONFIG.DAC2_Clock_Dist 1 \
  CONFIG.DAC2_Multi_Tile_Sync true \
  CONFIG.DAC2_Outclk_Freq 308.467 \
  CONFIG.DAC2_Refclk_Freq 4935.468 \
  CONFIG.DAC2_Sampling_Rate 4.935468 \
  CONFIG.DAC3_Clock_Source 6 \
  CONFIG.DAC3_Multi_Tile_Sync true \
  CONFIG.DAC3_Outclk_Freq 308.467 \
  CONFIG.DAC3_Refclk_Freq 4935.468 \
  CONFIG.DAC3_Sampling_Rate 4.935468 \
  CONFIG.DAC_Data_Width00 2 \
  CONFIG.DAC_Data_Width02 2 \
  CONFIG.DAC_Data_Width10 2 \
  CONFIG.DAC_Data_Width12 2 \
  CONFIG.DAC_Data_Width20 2 \
  CONFIG.DAC_Data_Width22 2 \
  CONFIG.DAC_Data_Width30 2 \
  CONFIG.DAC_Data_Width32 2 \
  CONFIG.DAC_Interpolation_Mode00 40 \
  CONFIG.DAC_Interpolation_Mode02 40 \
  CONFIG.DAC_Interpolation_Mode10 40 \
  CONFIG.DAC_Interpolation_Mode12 40 \
  CONFIG.DAC_Interpolation_Mode20 40 \
  CONFIG.DAC_Interpolation_Mode22 40 \
  CONFIG.DAC_Interpolation_Mode30 40 \
  CONFIG.DAC_Interpolation_Mode32 40 \
  CONFIG.DAC_Mixer_Mode00 0 \
  CONFIG.DAC_Mixer_Mode02 0 \
  CONFIG.DAC_Mixer_Mode10 0 \
  CONFIG.DAC_Mixer_Mode12 0 \
  CONFIG.DAC_Mixer_Mode20 0 \
  CONFIG.DAC_Mixer_Mode22 0 \
  CONFIG.DAC_Mixer_Mode30 0 \
  CONFIG.DAC_Mixer_Mode32 0 \
  CONFIG.DAC_Mixer_Type00 2 \
  CONFIG.DAC_Mixer_Type02 2 \
  CONFIG.DAC_Mixer_Type10 2 \
  CONFIG.DAC_Mixer_Type12 2 \
  CONFIG.DAC_Mixer_Type20 2 \
  CONFIG.DAC_Mixer_Type22 2 \
  CONFIG.DAC_Mixer_Type30 2 \
  CONFIG.DAC_Mixer_Type32 2 \
  CONFIG.DAC_Mode00 0 \
  CONFIG.DAC_NCO_Freq00 0.49964 \
  CONFIG.DAC_NCO_Freq02 0.49964 \
  CONFIG.DAC_NCO_Freq10 0.49964 \
  CONFIG.DAC_NCO_Freq12 0.49964 \
  CONFIG.DAC_NCO_Freq20 0.49964 \
  CONFIG.DAC_NCO_Freq22 0.49964 \
  CONFIG.DAC_NCO_Freq30 0.49964 \
  CONFIG.DAC_NCO_Freq32 0.49964 \
  CONFIG.DAC_Slice00_Enable true \
  CONFIG.DAC_Slice02_Enable true \
  CONFIG.DAC_Slice10_Enable true \
  CONFIG.DAC_Slice12_Enable true \
  CONFIG.DAC_Slice20_Enable true \
  CONFIG.DAC_Slice22_Enable true \
  CONFIG.DAC_Slice30_Enable true \
  CONFIG.DAC_Slice32_Enable true \
] [get_bd_cells usp_rf_data_converter_0]
create_bd_cell -type ip -vlnv xilinx.com:ip:zynq_ultra_ps_e:3.4 zynq_ultra_ps_e_0
set_property -dict [list \
  CONFIG.CAN0_BOARD_INTERFACE custom \
  CONFIG.CAN1_BOARD_INTERFACE custom \
  CONFIG.CSU_BOARD_INTERFACE custom \
  CONFIG.DP_BOARD_INTERFACE custom \
  CONFIG.GEM0_BOARD_INTERFACE custom \
  CONFIG.GEM1_BOARD_INTERFACE custom \
  CONFIG.GEM2_BOARD_INTERFACE custom \
  CONFIG.GEM3_BOARD_INTERFACE custom \
  CONFIG.GPIO_BOARD_INTERFACE custom \
  CONFIG.IIC0_BOARD_INTERFACE custom \
  CONFIG.IIC1_BOARD_INTERFACE custom \
  CONFIG.NAND_BOARD_INTERFACE custom \
  CONFIG.PCIE_BOARD_INTERFACE custom \
  CONFIG.PJTAG_BOARD_INTERFACE custom \
  CONFIG.PMU_BOARD_INTERFACE custom \
  CONFIG.PSU_BANK_0_IO_STANDARD LVCMOS18 \
  CONFIG.PSU_BANK_1_IO_STANDARD LVCMOS18 \
  CONFIG.PSU_BANK_2_IO_STANDARD LVCMOS18 \
  CONFIG.PSU_BANK_3_IO_STANDARD LVCMOS33 \
  CONFIG.PSU_USB3__DUAL_CLOCK_ENABLE 0 \
  CONFIG.PSU__CAN1__PERIPHERAL__ENABLE 0 \
  CONFIG.PSU__CRF_APB__ACPU_CTRL__FREQMHZ 1200 \
  CONFIG.PSU__CRF_APB__ACPU_CTRL__SRCSEL APLL \
  CONFIG.PSU__CRF_APB__APLL_CTRL__SRCSEL PSS_REF_CLK \
  CONFIG.PSU__CRF_APB__DBG_FPD_CTRL__FREQMHZ 250 \
  CONFIG.PSU__CRF_APB__DBG_FPD_CTRL__SRCSEL IOPLL \
  CONFIG.PSU__CRF_APB__DBG_TRACE_CTRL__FREQMHZ 250 \
  CONFIG.PSU__CRF_APB__DBG_TRACE_CTRL__SRCSEL IOPLL \
  CONFIG.PSU__CRF_APB__DBG_TSTMP_CTRL__FREQMHZ 250 \
  CONFIG.PSU__CRF_APB__DBG_TSTMP_CTRL__SRCSEL IOPLL \
  CONFIG.PSU__CRF_APB__DDR_CTRL__FREQMHZ 1067 \
  CONFIG.PSU__CRF_APB__DDR_CTRL__SRCSEL DPLL \
  CONFIG.PSU__CRF_APB__DPDMA_REF_CTRL__FREQMHZ 600 \
  CONFIG.PSU__CRF_APB__DPDMA_REF_CTRL__SRCSEL APLL \
  CONFIG.PSU__CRF_APB__DPLL_CTRL__SRCSEL PSS_REF_CLK \
  CONFIG.PSU__CRF_APB__DP_AUDIO_REF_CTRL__SRCSEL RPLL \
  CONFIG.PSU__CRF_APB__DP_STC_REF_CTRL__SRCSEL RPLL \
  CONFIG.PSU__CRF_APB__DP_VIDEO_REF_CTRL__SRCSEL VPLL \
  CONFIG.PSU__CRF_APB__GDMA_REF_CTRL__FREQMHZ 600 \
  CONFIG.PSU__CRF_APB__GDMA_REF_CTRL__SRCSEL APLL \
  CONFIG.PSU__CRF_APB__GPU_REF_CTRL__FREQMHZ 500 \
  CONFIG.PSU__CRF_APB__GPU_REF_CTRL__SRCSEL IOPLL \
  CONFIG.PSU__CRF_APB__TOPSW_LSBUS_CTRL__FREQMHZ 100 \
  CONFIG.PSU__CRF_APB__TOPSW_LSBUS_CTRL__SRCSEL IOPLL \
  CONFIG.PSU__CRF_APB__TOPSW_MAIN_CTRL__FREQMHZ 533.33 \
  CONFIG.PSU__CRF_APB__TOPSW_MAIN_CTRL__SRCSEL DPLL \
  CONFIG.PSU__CRF_APB__VPLL_CTRL__SRCSEL PSS_REF_CLK \
  CONFIG.PSU__CRL_APB__ADMA_REF_CTRL__FREQMHZ 500 \
  CONFIG.PSU__CRL_APB__ADMA_REF_CTRL__SRCSEL IOPLL \
  CONFIG.PSU__CRL_APB__CAN1_REF_CTRL__FREQMHZ 100 \
  CONFIG.PSU__CRL_APB__CAN1_REF_CTRL__SRCSEL IOPLL \
  CONFIG.PSU__CRL_APB__CPU_R5_CTRL__FREQMHZ 500 \
  CONFIG.PSU__CRL_APB__CPU_R5_CTRL__SRCSEL IOPLL \
  CONFIG.PSU__CRL_APB__DBG_LPD_CTRL__FREQMHZ 250 \
  CONFIG.PSU__CRL_APB__DBG_LPD_CTRL__SRCSEL IOPLL \
  CONFIG.PSU__CRL_APB__GEM3_REF_CTRL__FREQMHZ 125 \
  CONFIG.PSU__CRL_APB__GEM3_REF_CTRL__SRCSEL IOPLL \
  CONFIG.PSU__CRL_APB__I2C0_REF_CTRL__FREQMHZ 100 \
  CONFIG.PSU__CRL_APB__I2C0_REF_CTRL__SRCSEL IOPLL \
  CONFIG.PSU__CRL_APB__I2C1_REF_CTRL__FREQMHZ 100 \
  CONFIG.PSU__CRL_APB__I2C1_REF_CTRL__SRCSEL IOPLL \
  CONFIG.PSU__CRL_APB__IOPLL_CTRL__SRCSEL PSS_REF_CLK \
  CONFIG.PSU__CRL_APB__IOU_SWITCH_CTRL__FREQMHZ 250 \
  CONFIG.PSU__CRL_APB__IOU_SWITCH_CTRL__SRCSEL IOPLL \
  CONFIG.PSU__CRL_APB__LPD_LSBUS_CTRL__FREQMHZ 100 \
  CONFIG.PSU__CRL_APB__LPD_LSBUS_CTRL__SRCSEL IOPLL \
  CONFIG.PSU__CRL_APB__LPD_SWITCH_CTRL__FREQMHZ 500 \
  CONFIG.PSU__CRL_APB__LPD_SWITCH_CTRL__SRCSEL IOPLL \
  CONFIG.PSU__CRL_APB__PCAP_CTRL__FREQMHZ 200 \
  CONFIG.PSU__CRL_APB__PCAP_CTRL__SRCSEL IOPLL \
  CONFIG.PSU__CRL_APB__PL0_REF_CTRL__FREQMHZ 100 \
  CONFIG.PSU__CRL_APB__PL0_REF_CTRL__SRCSEL IOPLL \
  CONFIG.PSU__CRL_APB__QSPI_REF_CTRL__FREQMHZ 125 \
  CONFIG.PSU__CRL_APB__QSPI_REF_CTRL__SRCSEL IOPLL \
  CONFIG.PSU__CRL_APB__RPLL_CTRL__SRCSEL PSS_REF_CLK \
  CONFIG.PSU__CRL_APB__SDIO1_REF_CTRL__FREQMHZ 200 \
  CONFIG.PSU__CRL_APB__SDIO1_REF_CTRL__SRCSEL IOPLL \
  CONFIG.PSU__CRL_APB__TIMESTAMP_REF_CTRL__FREQMHZ 100 \
  CONFIG.PSU__CRL_APB__TIMESTAMP_REF_CTRL__SRCSEL IOPLL \
  CONFIG.PSU__CRL_APB__UART0_REF_CTRL__FREQMHZ 100 \
  CONFIG.PSU__CRL_APB__UART0_REF_CTRL__SRCSEL IOPLL \
  CONFIG.PSU__CRL_APB__UART1_REF_CTRL__FREQMHZ 100 \
  CONFIG.PSU__CRL_APB__UART1_REF_CTRL__SRCSEL IOPLL \
  CONFIG.PSU__CRL_APB__USB0_BUS_REF_CTRL__FREQMHZ 250 \
  CONFIG.PSU__CRL_APB__USB0_BUS_REF_CTRL__SRCSEL IOPLL \
  CONFIG.PSU__CRL_APB__USB3_DUAL_REF_CTRL__FREQMHZ 20 \
  CONFIG.PSU__CRL_APB__USB3_DUAL_REF_CTRL__SRCSEL IOPLL \
  CONFIG.PSU__CRL_APB__USB3__ENABLE 0 \
  CONFIG.PSU__CSUPMU__PERIPHERAL__VALID 1 \
  CONFIG.PSU__DDRC__BUS_WIDTH {64 Bit} \
  CONFIG.PSU__DDRC__COMPONENTS UDIMM \
  CONFIG.PSU__DDRC__DEVICE_CAPACITY {8192 MBits} \
  CONFIG.PSU__DDRC__DRAM_WIDTH {16 Bits} \
  CONFIG.PSU__DDRC__ECC Disabled \
  CONFIG.PSU__DDRC__MEMORY_TYPE {DDR 4} \
  CONFIG.PSU__DDRC__SPEED_BIN DDR4_2133P \
  CONFIG.PSU__DDR_HIGH_ADDRESS_GUI_ENABLE 1 \
  CONFIG.PSU__DDR__INTERFACE__FREQMHZ 533.500 \
  CONFIG.PSU__DEVICE_TYPE RFSOC \
  CONFIG.PSU__DISPLAYPORT__PERIPHERAL__ENABLE 0 \
  CONFIG.PSU__DLL__ISUSED 1 \
  CONFIG.PSU__ENET3__FIFO__ENABLE 0 \
  CONFIG.PSU__ENET3__GRP_MDIO__ENABLE 1 \
  CONFIG.PSU__ENET3__GRP_MDIO__IO {MIO 76 .. 77} \
  CONFIG.PSU__ENET3__PERIPHERAL__ENABLE 1 \
  CONFIG.PSU__ENET3__PERIPHERAL__IO {MIO 64 .. 75} \
  CONFIG.PSU__ENET3__PTP__ENABLE 0 \
  CONFIG.PSU__ENET3__TSU__ENABLE 0 \
  CONFIG.PSU__FPGA_PL0_ENABLE 1 \
  CONFIG.PSU__GEM3_COHERENCY 0 \
  CONFIG.PSU__GEM3_ROUTE_THROUGH_FPD 0 \
  CONFIG.PSU__GEM__TSU__ENABLE 0 \
  CONFIG.PSU__GPIO0_MIO__PERIPHERAL__ENABLE 0 \
  CONFIG.PSU__GPIO1_MIO__PERIPHERAL__ENABLE 0 \
  CONFIG.PSU__GPU_PP0__POWER__ON 0 \
  CONFIG.PSU__GPU_PP1__POWER__ON 0 \
  CONFIG.PSU__I2C0__PERIPHERAL__ENABLE 1 \
  CONFIG.PSU__I2C0__PERIPHERAL__IO {MIO 14 .. 15} \
  CONFIG.PSU__I2C1__PERIPHERAL__ENABLE 1 \
  CONFIG.PSU__I2C1__PERIPHERAL__IO {MIO 16 .. 17} \
  CONFIG.PSU__IOU_SLCR__IOU_TTC_APB_CLK__TTC0_SEL APB \
  CONFIG.PSU__IOU_SLCR__IOU_TTC_APB_CLK__TTC1_SEL APB \
  CONFIG.PSU__IOU_SLCR__IOU_TTC_APB_CLK__TTC2_SEL APB \
  CONFIG.PSU__IOU_SLCR__IOU_TTC_APB_CLK__TTC3_SEL APB \
  CONFIG.PSU__MAXIGP0__DATA_WIDTH 128 \
  CONFIG.PSU__OVERRIDE_HPX_QOS 0 \
  CONFIG.PSU__OVERRIDE__BASIC_CLOCK 0 \
  CONFIG.PSU__PMU_COHERENCY 0 \
  CONFIG.PSU__PMU__AIBACK__ENABLE 0 \
  CONFIG.PSU__PMU__EMIO_GPI__ENABLE 0 \
  CONFIG.PSU__PMU__EMIO_GPO__ENABLE 0 \
  CONFIG.PSU__PMU__GPI0__ENABLE 0 \
  CONFIG.PSU__PMU__GPI1__ENABLE 0 \
  CONFIG.PSU__PMU__GPI2__ENABLE 0 \
  CONFIG.PSU__PMU__GPI3__ENABLE 0 \
  CONFIG.PSU__PMU__GPI4__ENABLE 0 \
  CONFIG.PSU__PMU__GPI5__ENABLE 0 \
  CONFIG.PSU__PMU__GPO0__ENABLE 1 \
  CONFIG.PSU__PMU__GPO0__IO {MIO 32} \
  CONFIG.PSU__PMU__GPO1__ENABLE 1 \
  CONFIG.PSU__PMU__GPO1__IO {MIO 33} \
  CONFIG.PSU__PMU__GPO2__ENABLE 1 \
  CONFIG.PSU__PMU__GPO2__IO {MIO 34} \
  CONFIG.PSU__PMU__GPO2__POLARITY low \
  CONFIG.PSU__PMU__GPO3__ENABLE 1 \
  CONFIG.PSU__PMU__GPO3__IO {MIO 35} \
  CONFIG.PSU__PMU__GPO3__POLARITY low \
  CONFIG.PSU__PMU__GPO4__ENABLE 1 \
  CONFIG.PSU__PMU__GPO4__IO {MIO 36} \
  CONFIG.PSU__PMU__GPO4__POLARITY low \
  CONFIG.PSU__PMU__GPO5__ENABLE 1 \
  CONFIG.PSU__PMU__GPO5__IO {MIO 37} \
  CONFIG.PSU__PMU__GPO5__POLARITY low \
  CONFIG.PSU__PMU__PERIPHERAL__ENABLE 1 \
  CONFIG.PSU__PMU__PLERROR__ENABLE 0 \
  CONFIG.PSU__PRESET_APPLIED 1 \
  CONFIG.PSU__PSS_REF_CLK__FREQMHZ 33.333 \
  CONFIG.PSU__QSPI_COHERENCY 0 \
  CONFIG.PSU__QSPI_ROUTE_THROUGH_FPD 0 \
  CONFIG.PSU__QSPI__GRP_FBCLK__ENABLE 1 \
  CONFIG.PSU__QSPI__GRP_FBCLK__IO {MIO 6} \
  CONFIG.PSU__QSPI__PERIPHERAL__DATA_MODE x4 \
  CONFIG.PSU__QSPI__PERIPHERAL__ENABLE 1 \
  CONFIG.PSU__QSPI__PERIPHERAL__IO {MIO 0 .. 12} \
  CONFIG.PSU__QSPI__PERIPHERAL__MODE {Dual Parallel} \
  CONFIG.PSU__SATA__PERIPHERAL__ENABLE 0 \
  CONFIG.PSU__SD0__CLK_100_SDR_OTAP_DLY 0x3 \
  CONFIG.PSU__SD0__CLK_200_SDR_OTAP_DLY 0x3 \
  CONFIG.PSU__SD0__CLK_50_DDR_ITAP_DLY 0x3D \
  CONFIG.PSU__SD0__CLK_50_DDR_OTAP_DLY 0x4 \
  CONFIG.PSU__SD0__CLK_50_SDR_ITAP_DLY 0x15 \
  CONFIG.PSU__SD0__CLK_50_SDR_OTAP_DLY 0x5 \
  CONFIG.PSU__SD1_COHERENCY 0 \
  CONFIG.PSU__SD1_ROUTE_THROUGH_FPD 0 \
  CONFIG.PSU__SD1__CLK_100_SDR_OTAP_DLY 0x3 \
  CONFIG.PSU__SD1__CLK_200_SDR_OTAP_DLY 0x3 \
  CONFIG.PSU__SD1__CLK_50_DDR_ITAP_DLY 0x3D \
  CONFIG.PSU__SD1__CLK_50_DDR_OTAP_DLY 0x4 \
  CONFIG.PSU__SD1__CLK_50_SDR_ITAP_DLY 0x15 \
  CONFIG.PSU__SD1__CLK_50_SDR_OTAP_DLY 0x5 \
  CONFIG.PSU__SD1__DATA_TRANSFER_MODE 8Bit \
  CONFIG.PSU__SD1__GRP_CD__ENABLE 1 \
  CONFIG.PSU__SD1__GRP_CD__IO {MIO 45} \
  CONFIG.PSU__SD1__GRP_POW__ENABLE 0 \
  CONFIG.PSU__SD1__GRP_WP__ENABLE 0 \
  CONFIG.PSU__SD1__PERIPHERAL__ENABLE 1 \
  CONFIG.PSU__SD1__PERIPHERAL__IO {MIO 39 .. 51} \
  CONFIG.PSU__SD1__SLOT_TYPE {SD 3.0} \
  CONFIG.PSU__SWDT0__CLOCK__ENABLE 0 \
  CONFIG.PSU__SWDT0__PERIPHERAL__ENABLE 1 \
  CONFIG.PSU__SWDT0__RESET__ENABLE 0 \
  CONFIG.PSU__SWDT1__CLOCK__ENABLE 0 \
  CONFIG.PSU__SWDT1__PERIPHERAL__ENABLE 1 \
  CONFIG.PSU__SWDT1__RESET__ENABLE 0 \
  CONFIG.PSU__TSU__BUFG_PORT_PAIR 0 \
  CONFIG.PSU__TTC0__CLOCK__ENABLE 0 \
  CONFIG.PSU__TTC0__PERIPHERAL__ENABLE 1 \
  CONFIG.PSU__TTC0__WAVEOUT__ENABLE 0 \
  CONFIG.PSU__TTC1__CLOCK__ENABLE 0 \
  CONFIG.PSU__TTC1__PERIPHERAL__ENABLE 1 \
  CONFIG.PSU__TTC1__WAVEOUT__ENABLE 0 \
  CONFIG.PSU__TTC2__CLOCK__ENABLE 0 \
  CONFIG.PSU__TTC2__PERIPHERAL__ENABLE 1 \
  CONFIG.PSU__TTC2__WAVEOUT__ENABLE 0 \
  CONFIG.PSU__TTC3__CLOCK__ENABLE 0 \
  CONFIG.PSU__TTC3__PERIPHERAL__ENABLE 1 \
  CONFIG.PSU__TTC3__WAVEOUT__ENABLE 0 \
  CONFIG.PSU__UART0__BAUD_RATE 115200 \
  CONFIG.PSU__UART0__MODEM__ENABLE 0 \
  CONFIG.PSU__UART0__PERIPHERAL__ENABLE 1 \
  CONFIG.PSU__UART0__PERIPHERAL__IO {MIO 18 .. 19} \
  CONFIG.PSU__UART1__PERIPHERAL__ENABLE 0 \
  CONFIG.PSU__USB0__PERIPHERAL__ENABLE 0 \
  CONFIG.PSU__USE__IRQ0 1 \
  CONFIG.PSU__USE__M_AXI_GP0 1 \
  CONFIG.PSU__USE__M_AXI_GP1 1 \
  CONFIG.PSU__USE__M_AXI_GP2 0 \
  CONFIG.QSPI_BOARD_INTERFACE custom \
  CONFIG.SATA_BOARD_INTERFACE custom \
  CONFIG.SD0_BOARD_INTERFACE custom \
  CONFIG.SD1_BOARD_INTERFACE custom \
  CONFIG.SPI0_BOARD_INTERFACE custom \
  CONFIG.SPI1_BOARD_INTERFACE custom \
  CONFIG.SUBPRESET1 Custom \
  CONFIG.SUBPRESET2 Custom \
  CONFIG.SWDT0_BOARD_INTERFACE custom \
  CONFIG.SWDT1_BOARD_INTERFACE custom \
  CONFIG.TRACE_BOARD_INTERFACE custom \
  CONFIG.TTC0_BOARD_INTERFACE custom \
  CONFIG.TTC1_BOARD_INTERFACE custom \
  CONFIG.TTC2_BOARD_INTERFACE custom \
  CONFIG.TTC3_BOARD_INTERFACE custom \
  CONFIG.UART0_BOARD_INTERFACE custom \
  CONFIG.UART1_BOARD_INTERFACE custom \
  CONFIG.USB0_BOARD_INTERFACE custom \
  CONFIG.USB1_BOARD_INTERFACE custom \
] [get_bd_cells zynq_ultra_ps_e_0]
# 759 more settings of zynq_ultra_ps_e_0 are not shown: defaults, MIO pin electricals, DDR timing, and values the tool derives
create_bd_cell -type ip -vlnv xilinx.com:ip:ddr4:2.2 ddr4_0
set_property -dict [list \
  CONFIG.ADDN_UI_CLKOUT1_FREQ_HZ 100 \
  CONFIG.C0.CS_WIDTH 2 \
  CONFIG.C0.DDR4_AxiAddressWidth 32 \
  CONFIG.C0.DDR4_Clamshell true \
  CONFIG.C0_CLOCK_BOARD_INTERFACE default_sysclk_c0_300mhz \
  CONFIG.C0_DDR4_BOARD_INTERFACE ddr4_sdram_c0 \
  CONFIG.RESET_BOARD_INTERFACE reset \
] [get_bd_cells ddr4_0]
create_bd_cell -type ip -vlnv xilinx.com:ip:proc_sys_reset:5.0 rst_ddr_mig_0
create_bd_cell -type ip -vlnv xilinx.com:ip:smartconnect:1.0 ddr4_smc_0
set_property -dict {CONFIG.NUM_CLKS 3 CONFIG.NUM_SI 15} [get_bd_cells ddr4_smc_0]

# ---- connections ----

connect_bd_intf_net -intf_net adc23_2 [get_bd_intf_ports adc23] [get_bd_intf_pins usp_rf_data_converter_0/adc1_clk]
connect_bd_intf_net [get_bd_intf_ports dac0stream] [get_bd_intf_pins usp_rf_data_converter_0/s00_axis]
connect_bd_intf_net [get_bd_intf_ports dac1stream] [get_bd_intf_pins usp_rf_data_converter_0/s02_axis]
connect_bd_intf_net [get_bd_intf_ports dac2stream] [get_bd_intf_pins usp_rf_data_converter_0/s10_axis]
connect_bd_intf_net [get_bd_intf_ports dac3stream] [get_bd_intf_pins usp_rf_data_converter_0/s12_axis]
connect_bd_intf_net -intf_net dac45_1 [get_bd_intf_ports dac45] [get_bd_intf_pins usp_rf_data_converter_0/dac2_clk]
connect_bd_intf_net [get_bd_intf_ports dac4stream] [get_bd_intf_pins usp_rf_data_converter_0/s20_axis]
connect_bd_intf_net [get_bd_intf_ports dac5stream] [get_bd_intf_pins usp_rf_data_converter_0/s22_axis]
connect_bd_intf_net [get_bd_intf_ports dac6stream] [get_bd_intf_pins usp_rf_data_converter_0/s30_axis]
connect_bd_intf_net [get_bd_intf_ports dac7stream] [get_bd_intf_pins usp_rf_data_converter_0/s32_axis]
connect_bd_intf_net [get_bd_intf_ports ddr4_sdram] [get_bd_intf_pins ddr4_0/C0_DDR4]
connect_bd_intf_net [get_bd_intf_pins ps8_0_axi_periph/M00_AXI] [get_bd_intf_pins usp_rf_data_converter_0/s_axi]
connect_bd_intf_net [get_bd_intf_pins ps8_0_axi_periph/M01_AXI] [get_bd_intf_pins axi_lite_generic_reg_0/s00_axi]
connect_bd_intf_net [get_bd_intf_pins ps8_0_axi_periph/M02_AXI] [get_bd_intf_pins evr_axi_0/s00_axi]
connect_bd_intf_net [get_bd_intf_pins ps8_0_axi_periph/M03_AXI] [get_bd_intf_pins rfadc_mmcm/s_axi_lite]
connect_bd_intf_net -intf_net smartconnect_0_M00_AXI [get_bd_intf_pins ddr4_smc_0/M00_AXI] [get_bd_intf_pins ddr4_0/C0_DDR4_S_AXI]
connect_bd_intf_net [get_bd_intf_pins ddr4_smc_0/M00_AXI] [get_bd_intf_ports ddr_aximm_dbg]
connect_bd_intf_net [get_bd_intf_ports sys_clk_300mhz] [get_bd_intf_pins ddr4_0/C0_SYS_CLK]
connect_bd_intf_net [get_bd_intf_ports sysref_in] [get_bd_intf_pins usp_rf_data_converter_0/sysref_in]
connect_bd_intf_net [get_bd_intf_ports adc0stream] [get_bd_intf_pins usp_rf_data_converter_0/m00_axis]
connect_bd_intf_net [get_bd_intf_ports adc0Qstream] [get_bd_intf_pins usp_rf_data_converter_0/m01_axis]
connect_bd_intf_net [get_bd_intf_ports adc1stream] [get_bd_intf_pins usp_rf_data_converter_0/m02_axis]
connect_bd_intf_net [get_bd_intf_ports adc1Qstream] [get_bd_intf_pins usp_rf_data_converter_0/m03_axis]
connect_bd_intf_net [get_bd_intf_ports adc2stream] [get_bd_intf_pins usp_rf_data_converter_0/m10_axis]
connect_bd_intf_net [get_bd_intf_ports adc2Qstream] [get_bd_intf_pins usp_rf_data_converter_0/m11_axis]
connect_bd_intf_net [get_bd_intf_ports adc3stream] [get_bd_intf_pins usp_rf_data_converter_0/m12_axis]
connect_bd_intf_net [get_bd_intf_ports adc3Qstream] [get_bd_intf_pins usp_rf_data_converter_0/m13_axis]
connect_bd_intf_net [get_bd_intf_ports adc4stream] [get_bd_intf_pins usp_rf_data_converter_0/m20_axis]
connect_bd_intf_net [get_bd_intf_ports adc4Qstream] [get_bd_intf_pins usp_rf_data_converter_0/m21_axis]
connect_bd_intf_net [get_bd_intf_ports adc5stream] [get_bd_intf_pins usp_rf_data_converter_0/m22_axis]
connect_bd_intf_net [get_bd_intf_ports adc5Qstream] [get_bd_intf_pins usp_rf_data_converter_0/m23_axis]
connect_bd_intf_net [get_bd_intf_ports adc6stream] [get_bd_intf_pins usp_rf_data_converter_0/m30_axis]
connect_bd_intf_net [get_bd_intf_ports adc6Qstream] [get_bd_intf_pins usp_rf_data_converter_0/m31_axis]
connect_bd_intf_net [get_bd_intf_ports adc7stream] [get_bd_intf_pins usp_rf_data_converter_0/m32_axis]
connect_bd_intf_net [get_bd_intf_ports adc7Qstream] [get_bd_intf_pins usp_rf_data_converter_0/m33_axis]
connect_bd_intf_net [get_bd_intf_ports vout0] [get_bd_intf_pins usp_rf_data_converter_0/vout00]
connect_bd_intf_net [get_bd_intf_ports vout1] [get_bd_intf_pins usp_rf_data_converter_0/vout02]
connect_bd_intf_net [get_bd_intf_ports vout2] [get_bd_intf_pins usp_rf_data_converter_0/vout10]
connect_bd_intf_net [get_bd_intf_ports vout3] [get_bd_intf_pins usp_rf_data_converter_0/vout12]
connect_bd_intf_net [get_bd_intf_ports vout4] [get_bd_intf_pins usp_rf_data_converter_0/vout20]
connect_bd_intf_net [get_bd_intf_ports vout5] [get_bd_intf_pins usp_rf_data_converter_0/vout22]
connect_bd_intf_net [get_bd_intf_ports vout6] [get_bd_intf_pins usp_rf_data_converter_0/vout30]
connect_bd_intf_net [get_bd_intf_ports vout7] [get_bd_intf_pins usp_rf_data_converter_0/vout32]
connect_bd_intf_net [get_bd_intf_ports vin0] [get_bd_intf_pins usp_rf_data_converter_0/vin0_01]
connect_bd_intf_net -intf_net vin1_1 [get_bd_intf_ports vin1] [get_bd_intf_pins usp_rf_data_converter_0/vin0_23]
connect_bd_intf_net -intf_net vin1_23_0_1 [get_bd_intf_ports vin3] [get_bd_intf_pins usp_rf_data_converter_0/vin1_23]
connect_bd_intf_net -intf_net vin2_01_0_1 [get_bd_intf_ports vin4] [get_bd_intf_pins usp_rf_data_converter_0/vin2_01]
connect_bd_intf_net -intf_net vin2_1 [get_bd_intf_ports vin2] [get_bd_intf_pins usp_rf_data_converter_0/vin1_01]
connect_bd_intf_net -intf_net vin2_23_0_1 [get_bd_intf_ports vin5] [get_bd_intf_pins usp_rf_data_converter_0/vin2_23]
connect_bd_intf_net -intf_net vin3_01_0_1 [get_bd_intf_ports vin6] [get_bd_intf_pins usp_rf_data_converter_0/vin3_01]
connect_bd_intf_net -intf_net vin3_23_0_1 [get_bd_intf_ports vin7] [get_bd_intf_pins usp_rf_data_converter_0/vin3_23]
connect_bd_intf_net [get_bd_intf_ports wr_adc_1_axi] [get_bd_intf_pins ddr4_smc_0/S08_AXI]
connect_bd_intf_net -intf_net wr_adc_axi_1 [get_bd_intf_ports wr_adc_0_axi] [get_bd_intf_pins ddr4_smc_0/S01_AXI]
connect_bd_intf_net [get_bd_intf_ports wr_fa_1_axi] [get_bd_intf_pins ddr4_smc_0/S10_AXI]
connect_bd_intf_net -intf_net wr_fa_axi_1 [get_bd_intf_ports wr_fa_0_axi] [get_bd_intf_pins ddr4_smc_0/S03_AXI]
connect_bd_intf_net [get_bd_intf_ports wr_fa_pos_0_axi] [get_bd_intf_pins ddr4_smc_0/S07_AXI]
connect_bd_intf_net [get_bd_intf_ports wr_fa_pos_1_axi] [get_bd_intf_pins ddr4_smc_0/S14_AXI]
connect_bd_intf_net [get_bd_intf_ports wr_ph_1_axi] [get_bd_intf_pins ddr4_smc_0/S12_AXI]
connect_bd_intf_net -intf_net wr_ph_axi_1 [get_bd_intf_ports wr_ph_0_axi] [get_bd_intf_pins ddr4_smc_0/S05_AXI]
connect_bd_intf_net [get_bd_intf_ports wr_pl_1_axi] [get_bd_intf_pins ddr4_smc_0/S11_AXI]
connect_bd_intf_net -intf_net wr_pl_axi_1 [get_bd_intf_ports wr_pl_0_axi] [get_bd_intf_pins ddr4_smc_0/S04_AXI]
connect_bd_intf_net [get_bd_intf_ports wr_tbt_1_axi] [get_bd_intf_pins ddr4_smc_0/S09_AXI]
connect_bd_intf_net -intf_net wr_tbt_axi_1 [get_bd_intf_ports wr_tbt_0_axi] [get_bd_intf_pins ddr4_smc_0/S02_AXI]
connect_bd_intf_net [get_bd_intf_ports wr_tbt_pos_0_axi] [get_bd_intf_pins ddr4_smc_0/S06_AXI]
connect_bd_intf_net [get_bd_intf_ports wr_tbt_pos_1_axi] [get_bd_intf_pins ddr4_smc_0/S13_AXI]
connect_bd_intf_net [get_bd_intf_pins zynq_ultra_ps_e_0/M_AXI_HPM0_FPD] [get_bd_intf_pins ps8_0_axi_periph/S00_AXI]
connect_bd_intf_net [get_bd_intf_pins zynq_ultra_ps_e_0/M_AXI_HPM1_FPD] [get_bd_intf_pins ddr4_smc_0/S00_AXI]
connect_bd_net [get_bd_ports FPGA_REFCLK_OUT_C] [get_bd_pins rfadc_mmcm/clk_in1]
connect_bd_net [get_bd_ports GPIO_IN] [get_bd_pins axi_lite_generic_reg_0/GPIO_IN]
connect_bd_net [get_bd_pins Zero/dout] [get_bd_pins evr_axi_0/TsRequest]
connect_bd_net [get_bd_pins axi_lite_generic_reg_0/GPIO_OUT] [get_bd_ports GPIO_OUT]
connect_bd_net [get_bd_pins axi_lite_generic_reg_0/GPIO_STROBES] [get_bd_ports GPIO_STROBES]
connect_bd_net -net clk_wiz_0_clk_out1 [get_bd_pins rfadc_mmcm/clk_out1] \
  [get_bd_ports adcClk] [get_bd_pins usp_rf_data_converter_0/m0_axis_aclk] [get_bd_pins usp_rf_data_converter_0/m1_axis_aclk] \
  [get_bd_pins usp_rf_data_converter_0/m2_axis_aclk] [get_bd_pins usp_rf_data_converter_0/m3_axis_aclk] \
  [get_bd_pins ddr4_smc_0/aclk1]
